# EAGLE design BNC-V002 (EAGLE 6.5.0)
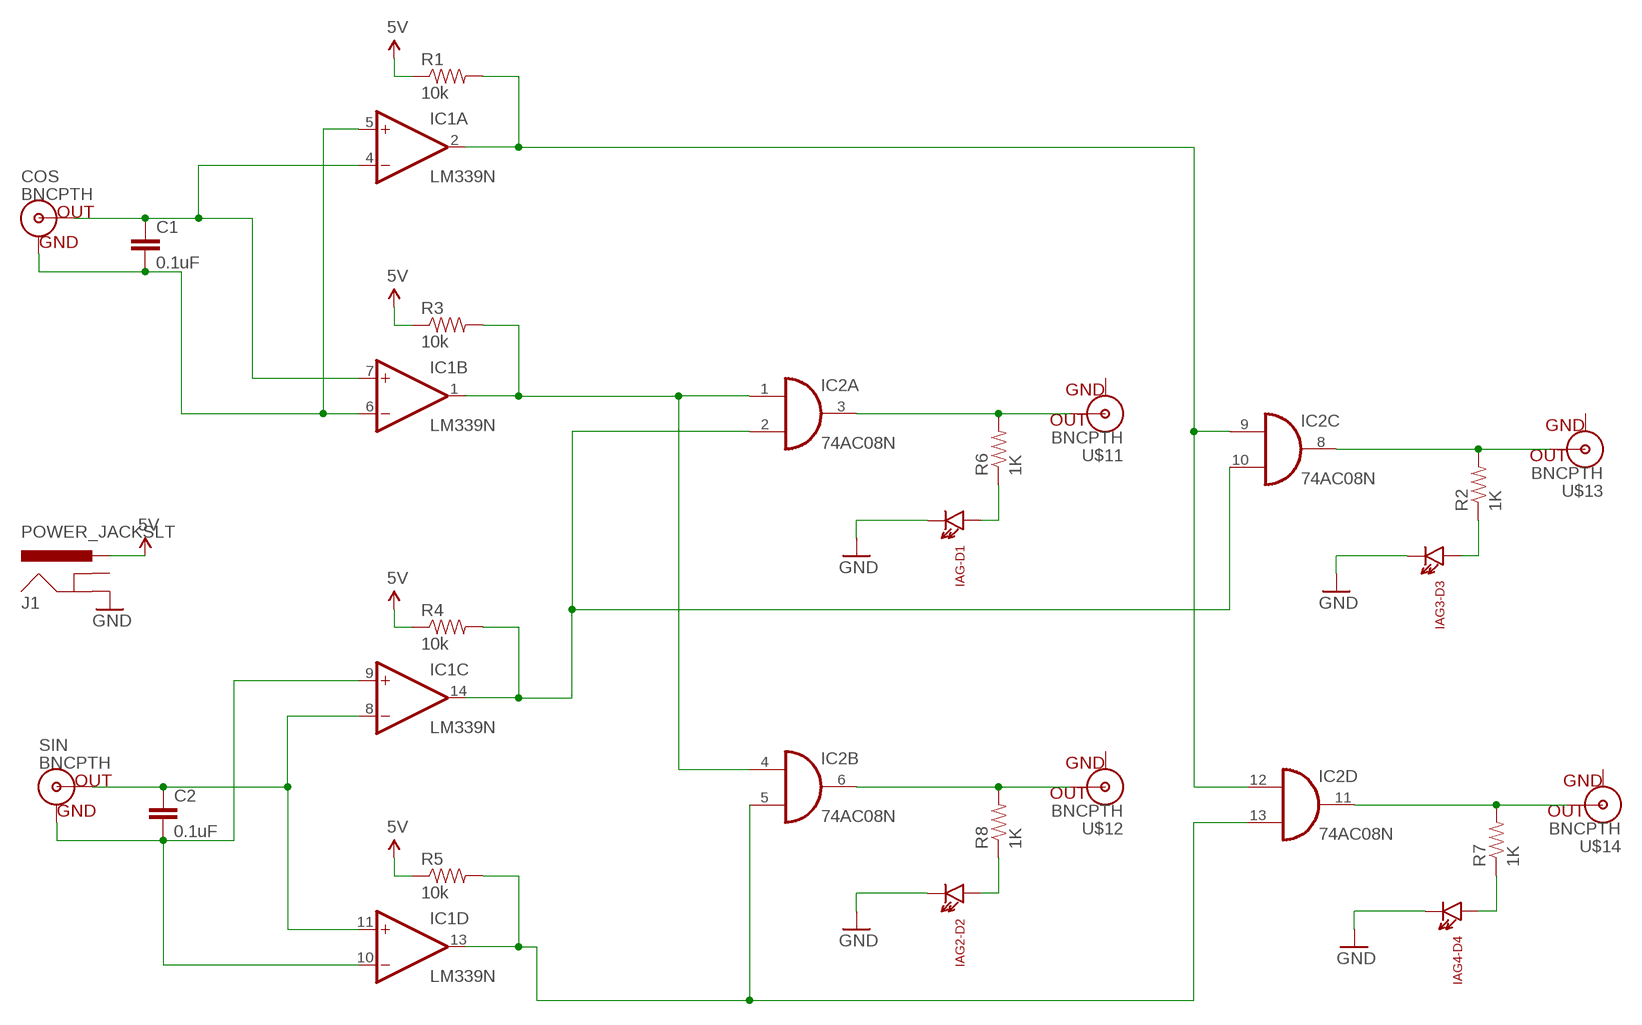
[diagram p0: schematic, sheet 1]

## Parts
C1  0.1uF  0.1UF-25V-5%(0603)  [0603-CAP]
C2  0.1uF  0.1UF-25V-5%(0603)  [0603-CAP]
COS  BNCPTH  [BNC]
IAG2-D2  LTE-302  [LTE-302]
IAG3-D3  LTE-302  [LTE-302]
IAG4-D4  LTE-302  [LTE-302]
IAG-D1  LTE-302  [LTE-302]
IC1  LM339N  [DIL14]
IC2  74AC08N  [DIL14]
J1  POWER_JACKSLT  [POWER_JACK_SLOT]
R1  10k  10KOHM-1/4W-1%(PTH)HORIZ  [AXIAL-0.3]
R2  1K  1KOHM-1/4W-1%(PTH)  [AXIAL-0.3]
R3  10k  10KOHM-1/4W-1%(PTH)HORIZ  [AXIAL-0.3]
R4  10k  10KOHM-1/4W-1%(PTH)HORIZ  [AXIAL-0.3]
R5  10k  10KOHM-1/4W-1%(PTH)HORIZ  [AXIAL-0.3]
R6  1K  1KOHM-1/4W-1%(PTH)  [AXIAL-0.3]
R7  1K  1KOHM-1/4W-1%(PTH)  [AXIAL-0.3]
R8  1K  1KOHM-1/4W-1%(PTH)  [AXIAL-0.3]
SIN  BNCPTH  [BNC]
U$11  BNCPTH  [BNC]
U$12  BNCPTH  [BNC]
U$13  BNCPTH  [BNC]
U$14  BNCPTH  [BNC]

## Nets
5V: J1.PWR R1.P$1 R3.P$1 R4.P$1 R5.P$1
GND: IAG2-D2.C IAG3-D3.C IAG4-D4.C IAG-D1.C J1.GND@2(GND)
N$1: IC1.2(A:OUT) IC2.9(C:I0) IC2.12(D:I0) R1.P$2
N$2: IC2.11(D:O) R7.P$2 U$14.S(OUT)
N$3: IAG4-D4.A R7.P$1
N$4: IC1.1(B:OUT) IC2.1(A:I0) IC2.4(B:I0) R3.P$2
N$5: IC1.14(C:OUT) IC2.2(A:I1) IC2.10(C:I1) R4.P$2
N$6: IC1.13(D:OUT) IC2.5(B:I1) IC2.13(D:I1) R5.P$2
N$7: C1.2 COS.GND IC1.5(A:+IN) IC1.6(B:-IN)
N$8: C1.1 COS.S(OUT) IC1.4(A:-IN) IC1.7(B:+IN)
N$9: C2.1 IC1.8(C:-IN) IC1.11(D:+IN) SIN.S(OUT)
N$11: C2.2 IC1.9(C:+IN) IC1.10(D:-IN) SIN.GND
N$12: IC2.8(C:O) R2.P$2 U$13.S(OUT)
N$13: IAG3-D3.A R2.P$1
N$14: IC2.6(B:O) R8.P$2 U$12.S(OUT)
N$15: IAG2-D2.A R8.P$1
N$16: IC2.3(A:O) R6.P$2 U$11.S(OUT)
N$17: IAG-D1.A R6.P$1
Unconnected: J1.GND@1(GNDBREAK) U$11.GND U$12.GND U$13.GND U$14.GND

## Power pins joined to a net without a drawn wire
GND: IC1.12(P:GND) IC2.7(P:GND)
V+: IC1.3(P:V+)
VCC: IC2.14(P:VCC)

## Library data of the parts
C1 C2 = SparkFun-Capacitors:0.1UF-25V-5%(0603): CAP-08604; PROD_ID: CAP-08604
COS SIN U$11-U$14 = SparkFun-Connectors:BNC: BNC Connector, Mouser Part# 5227161
IAG2-D2 IAG3-D3 IAG4-D4 IAG-D1 = SparkFun-LED:LTE-302: Through-hole side-firing 940nm IR LED
IC1 = linear:LM339: Low Power Low Offset Voltage Quad Comparators with open collector; LM139/LM239/LM339/LM2901/LM3302
IC2 = 74xx-eu:74*08: Quad 2-input AND gate
J1 = SparkFun-Connectors:POWER_JACK: Power Jack This is the standard 5.5mm barrel jack for power. The PTH is the most common, proven, reliable, footprint. The Slot footprint only works if the mill layer is transmitted to the PCB fab house so be warned. Mating wall wart : TOL-00298 (and others); PROD_ID: PRT-00119
R1 R3-R5 = SparkFun-Resistors:10KOHM-1/4W-1%(PTH): RES-12183; PROD_ID: RES-12183
R2 R6-R8 = SparkFun-Resistors:1KOHM-1/4W-1%(PTH): RES-12182; PROD_ID: RES-12182

## Board
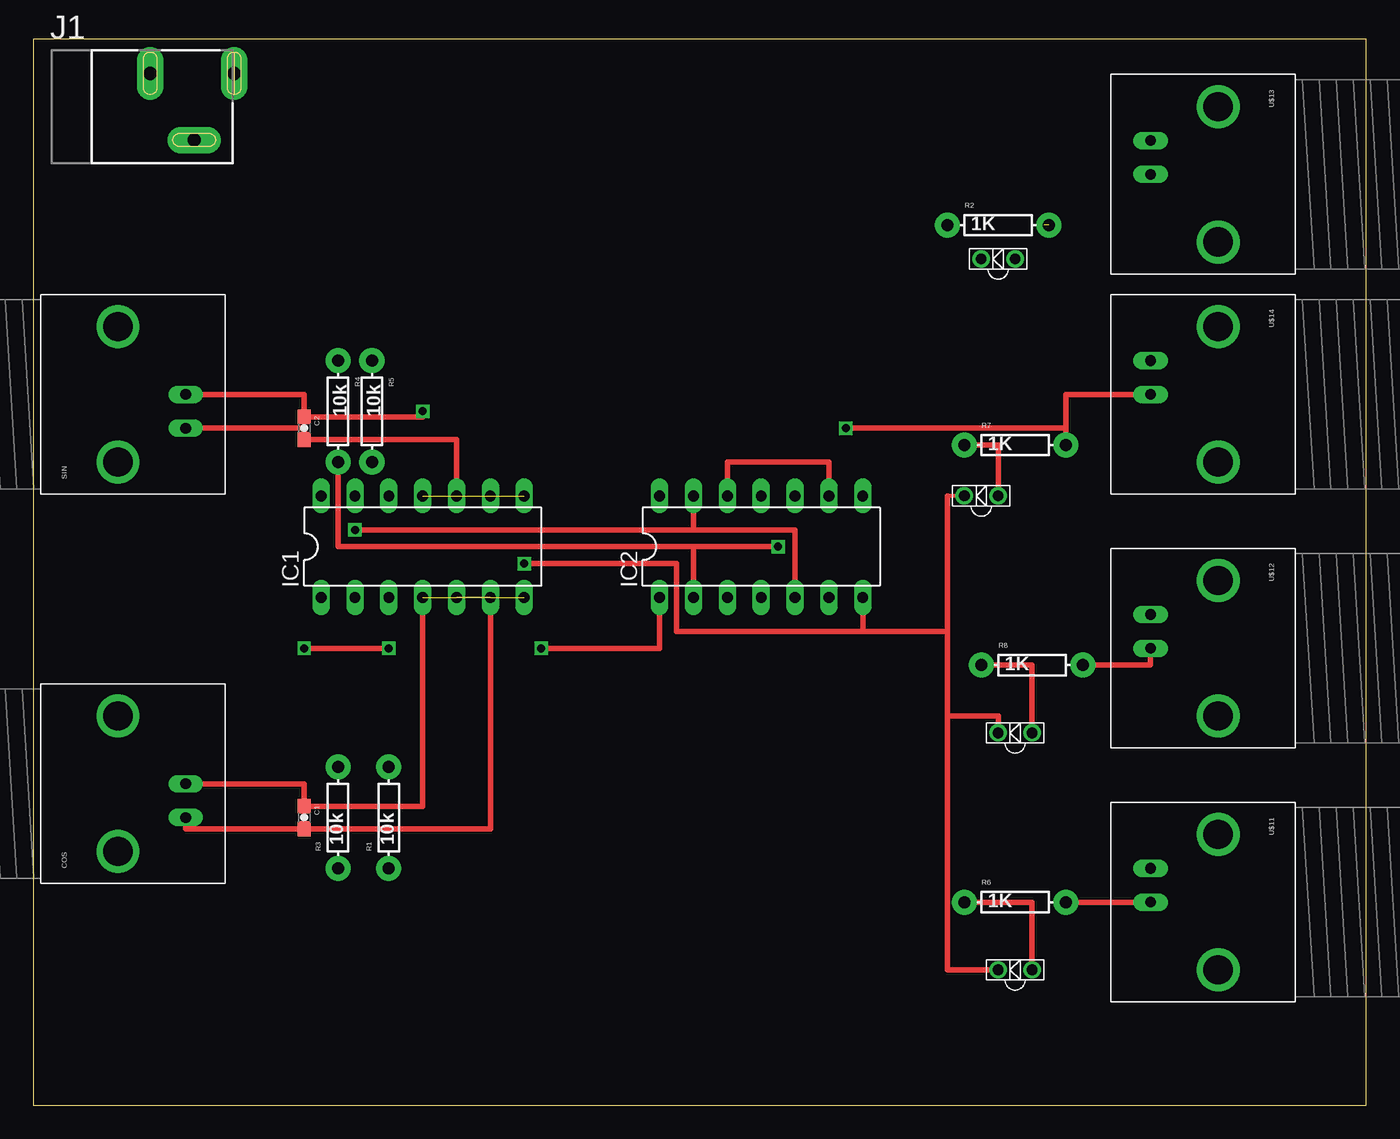
[diagram p1: board, top side]
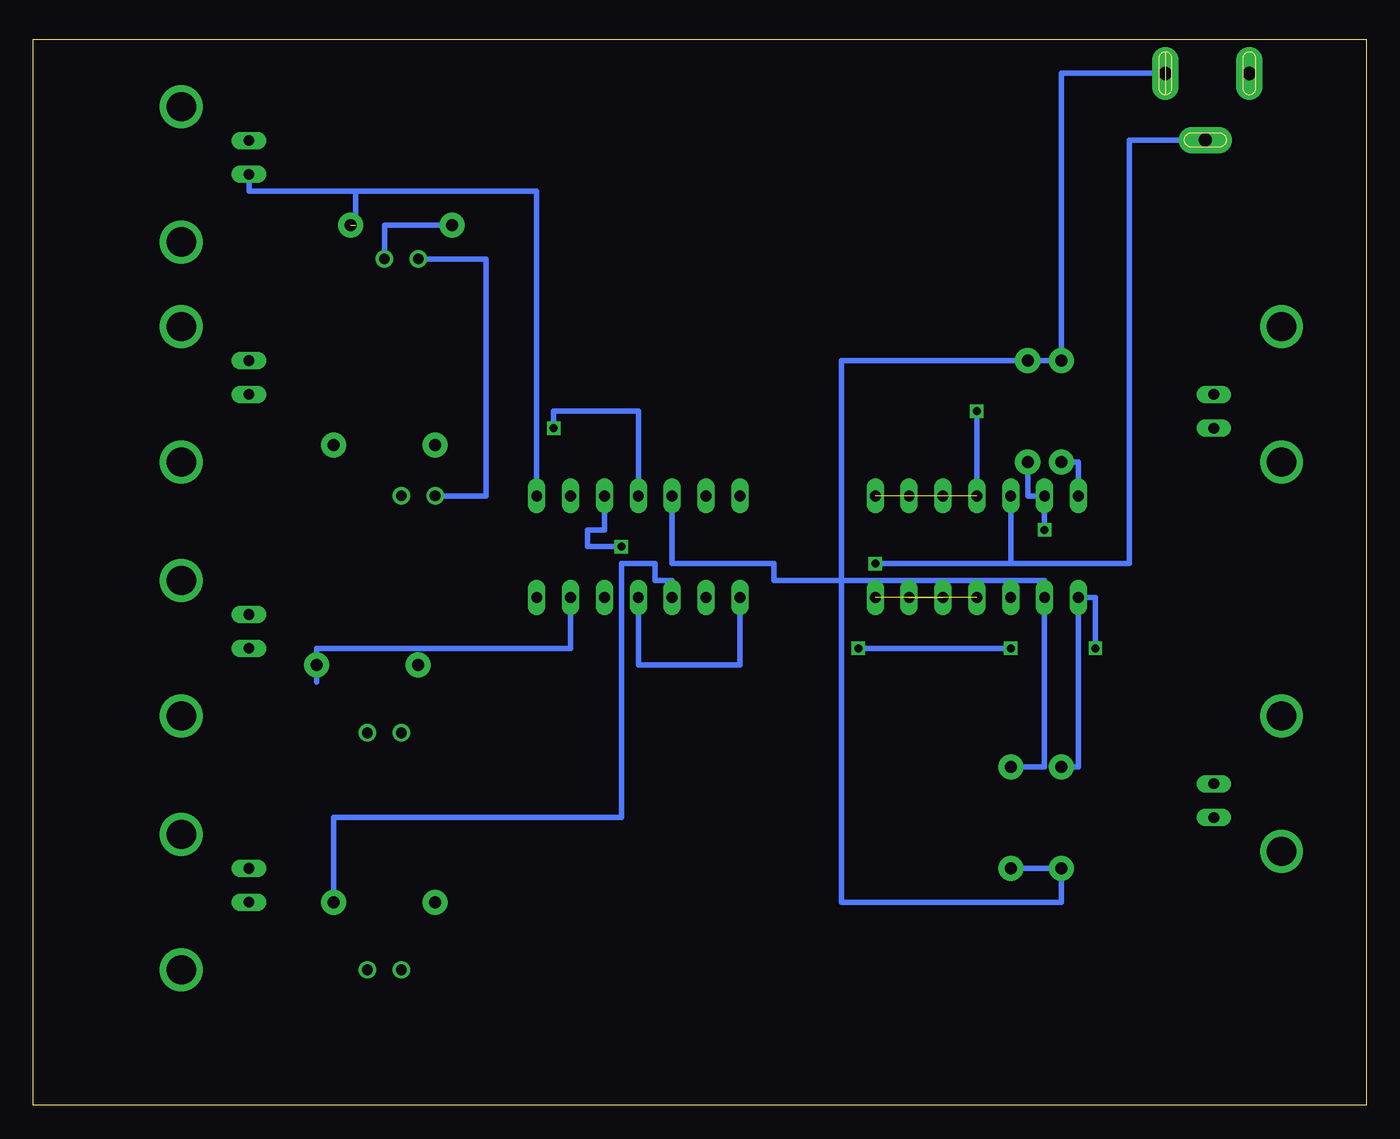
[diagram p2: board, bottom side, seen from below]

Size 100 x 80 mm. Coordinates in mm from the lower left corner, seen from the top.
Outline: 0,0 100,0 100,80 0,80 0,0
Copper layers (1*16): Top 0.035mm / dielectric 1.5mm / Bottom 0.035mm
Design rules "default": minimum track width 10mil, minimum drill 24mil, track to track 8mil, track to pad 8mil, pad to pad 8mil, via to via 8mil, smd to smd 8mil, copper to edge 40mil, drill to drill 8mil, minimum pad ring 10mil, minimum via ring 8mil, stop-mask expansion 4mil, vias tented up to drill 0mil, thermal gap 10mil

### Footprints (pad centres in the part's own frame; a part is rotated, then mirrored left to right if it is on the bottom)
0603-CAP = smd 1.1 x 1: 1 -0.85,0; 2 0.85,0
BNC = drill 2.2: 3 -5.08,5.08; 4 5.08,5.08 | drill 0.8 long: GND -2.54,0; S 0,0
LTE-302 = drill 0.8: A 1.27,0; C -1.27,0
DIL14 = drill 0.813 long: 1 -7.62,-3.81; 2 -5.08,-3.81; 3 -2.54,-3.81; 4 0,-3.81; 5 2.54,-3.81; 6 5.08,-3.81; 7 7.62,-3.81; 8 7.62,3.81; 9 5.08,3.81; 10 2.54,3.81; 11 0,3.81; 12 -2.54,3.81; 13 -5.08,3.81; 14 -7.62,3.81
POWER_JACK_SLOT = drill 1 pad 2 long: GND@1 2.58,7.5; GND@2 7.58,10.8; PWR 2.58,13.8
AXIAL-0.3 = drill 0.9 pad 1.88: P$1 -3.81,0; P$2 3.81,0

### Placement (x,y rotation side)
C1  20.32,21.59 270 top
C2  20.32,50.8 270 top
COS  11.43,24.13 90 top
IAG2-D2  73.66,27.94 0 top
IAG3-D3  72.39,63.5 0 top
IAG4-D4  71.12,45.72 0 top
IAG-D1  73.66,10.16 0 top
IC1  29.21,41.91 0 top
IC2  54.61,41.91 0 top
J1  1.27,80.01 270 top
R1  26.67,21.59 90 top
R2  72.39,66.04 0 top
R3  22.86,21.59 90 top
R4  22.86,52.07 270 top
R5  25.4,52.07 270 top
R6  73.66,15.24 0 top
R7  73.66,49.53 0 top
R8  74.93,33.02 0 top
SIN  11.43,53.34 90 top
U$11  83.82,15.24 270 top
U$12  83.82,34.29 270 top
U$13  83.82,69.85 270 top
U$14  83.82,53.34 270 top

### Tracks (layer width: path | path; a pad name or v marks a point on that pad's centre or on a via)
5V
  Bottom 0.406: J1.PWR 22.86,77.43 R4.P$1 | R4.P$1 R5.P$1 | R4.P$1 39.37,55.88 39.37,15.24 22.86,15.24 R3.P$1 R1.P$1
GND  (via drill 0.6)
  Top 0.305: 69.82,45.72 IAG4-D4.C 68.58,45.72 | IAG-D1.C 72.36,10.16
  Top 0.406: v36.83,40.64 48.26,40.64 48.26,35.56 62.23,35.56 | 62.23,35.56 IC2.7 | 68.58,45.72 68.58,35.56 | 68.58,35.56 62.23,35.56 | 68.58,35.56 68.58,29.21 | 68.58,29.21 72.39,29.21 IAG2-D2.C | IAG-D1.C 68.58,10.16 68.58,29.21
  Bottom 0.406: J1.GND@2 17.78,72.43 17.78,40.64 26.67,40.64 | 26.67,40.64 IC1.12 | 26.67,40.64 v36.83,40.64 | IAG3-D3.C 66.04,63.5 66.04,45.72 IAG4-D4.C
N$1
  Top 0.406: IC2.9 59.69,48.26 52.07,48.26 IC2.12
  Bottom 0.406: R1.P$2 24.13,25.4 IC1.2 24.13,39.37 44.45,39.37 44.45,40.64 52.07,40.64 IC2.12
N$2  (via drill 0.6)
  Top 0.406: U$14.S 77.47,53.34 77.47,50.8 | 77.47,50.8 R7.P$2 | v60.96,50.8 77.47,50.8
  Bottom 0.406: IC2.11 54.61,52.07 60.96,52.07 v60.96,50.8
N$3
  Top 0.406: R7.P$1 72.39,49.53 IAG4-D4.A
N$4  (via drill 0.6)
  Top 0.406: v20.32,34.29 v26.67,34.29 | v38.1,34.29 46.99,34.29 IC2.1
  Bottom 0.406: R3.P$2 21.59,25.4 IC1.1 20.32,38.1 v20.32,34.29 | v26.67,34.29 v38.1,34.29 | IC2.1 46.99,33.02 54.61,33.02 IC2.4
N$5  (via drill 0.6)
  Top 0.406: R4.P$2 22.86,41.91 49.53,41.91 | 49.53,41.91 IC2.2 | 49.53,41.91 v55.88,41.91
  Bottom 0.406: R4.P$2 21.59,48.26 IC1.14 | v55.88,41.91 58.42,41.91 58.42,43.18 57.15,43.18 IC2.10
N$6  (via drill 0.6)
  Top 0.406: v24.13,43.18 49.53,43.18 | 49.53,43.18 IC2.13 | 49.53,43.18 57.15,43.18 IC2.5
  Bottom 0.406: R5.P$2 25.4,45.72 IC1.13 v24.13,43.18
N$7  (1 unrouted)
  Top 0.406: IC1.6 34.29,20.74 C1.2 11.43,20.74 COS.GND
N$8  (1 unrouted)
  Top 0.406: IC1.4 29.21,22.44 C1.1 20.32,24.13 COS.S
N$9  (via drill 0.6)  (1 unrouted)
  Top 0.406: SIN.S 20.32,53.34 C2.1 29.21,51.65 v29.21,52.07
  Bottom 0.406: v29.21,52.07 IC1.11
N$11  (1 unrouted)
  Top 0.406: SIN.GND 20.32,50.8 C2.2 31.75,49.95 IC1.10
N$12  (1 unrouted)
  Bottom 0.406: IC2.8 62.23,68.58 75.83,68.58 | 75.83,68.58 75.83,66.04 | 75.83,68.58 83.82,68.58 U$13.S
N$13
  Top 0.305: IAG3-D3.A 74.03,63.5
  Bottom 0.406: R2.P$1 73.66,66.04 IAG3-D3.A
N$14
  Top 0.406: R8.P$2 83.82,33.02 U$12.S
  Bottom 0.406: IC2.6 59.69,34.29 78.74,34.29 R8.P$2 78.74,31.75
N$15
  Top 0.406: R8.P$1 74.93,33.02 IAG2-D2.A
N$16
  Top 0.305: 83.82,15.56 U$11.S
  Top 0.406: R6.P$2 U$11.S
  Bottom 0.406: R6.P$2 77.47,21.59 55.88,21.59 55.88,40.64 53.34,40.64 53.34,39.37 52.07,39.37 IC2.3
N$17
  Top 0.406: R6.P$1 74.93,15.24 IAG-D1.A